# Altium project Stabilizer_Piezo_Driver.PrjPCB (part 1 of 2)
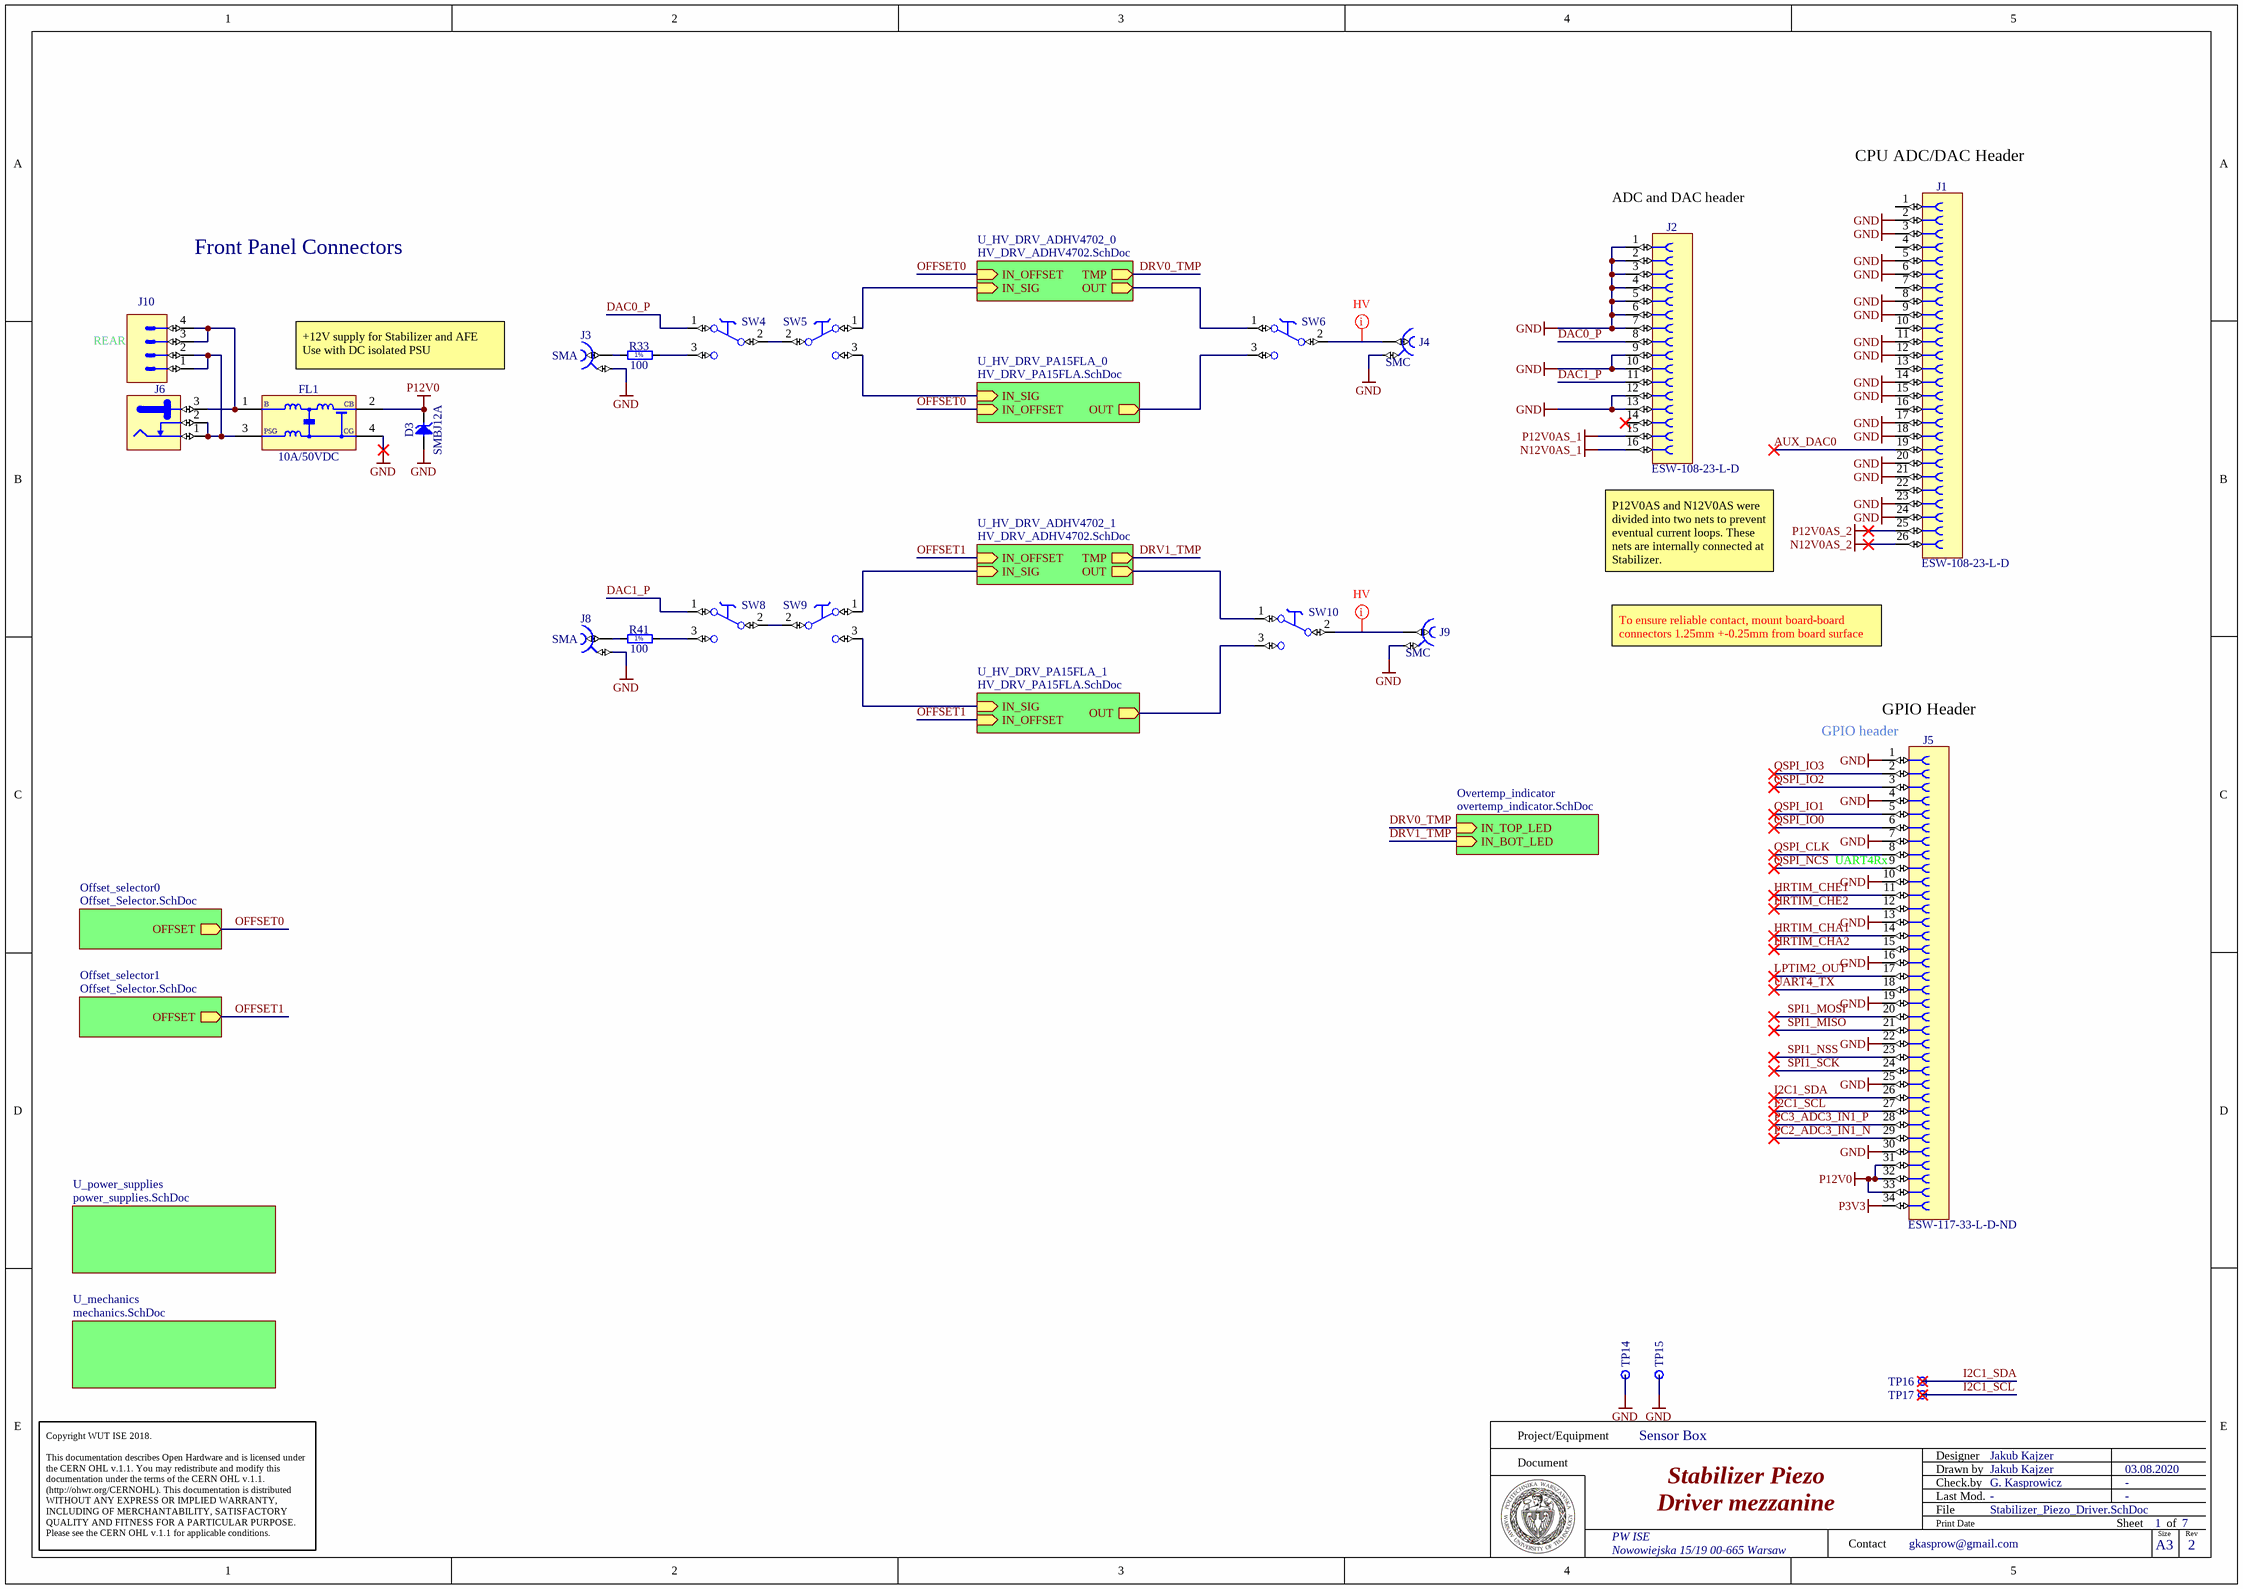
[diagram p0: Stabilizer_Piezo_Driver.SchDoc]
ProjAddress1: Department of Physics; ProjAddress2: University of Oxford; ProjAddress3: UK; ProjOrganization: Ion Trapping Group; ProjRevision: 1.0
7 sheets, 236 parts. Net scope: hierarchical (ports join the sheet entries above them; power ports are global).
Board file: Stabilizer_Piezo_Driver.PcbDoc
Sheets:
  Stabilizer_Piezo_Driver.SchDoc
    U_power_supplies = power_supplies.SchDoc
    U_mechanics = mechanics.SchDoc
    U_HV_DRV_ADHV4702_1 = HV_DRV_ADHV4702.SchDoc
    U_HV_DRV_PA15FLA_0 = HV_DRV_PA15FLA.SchDoc
    U_HV_DRV_PA15FLA_1 = HV_DRV_PA15FLA.SchDoc
    Overtemp_indicator = overtemp_indicator.SchDoc
    Offset_selector0 = Offset_Selector.SchDoc
    Offset_selector1 = Offset_Selector.SchDoc
    U_HV_DRV_ADHV4702_0 = HV_DRV_ADHV4702.SchDoc

## Sheet Stabilizer_Piezo_Driver.SchDoc: Stabilizer Piezo
size 420 x 297 mm; CheckedBy: G. Kasprowicz; Author: Jakub Kajzer; CompanyName: WUT ISE; DrawnBy: Jakub Kajzer; Organization: WUT ISE; Address1: PW ISE; Address2: Nowowiejska 15/19 00-665 Warsaw; Address3: gkasprow@gmail.com; DocumentNumber: 1; Revision: 2; SheetNumber: 1; SheetTotal: 7; ModifiedBy: -; CreateDate: 03.08.2020; CheckedDate: -; Title2: Driver mezzanine; DivGrp: WUT ISE; Designer: Jakub Kajzer; ModifiedDate: -; ProjectName: Sensor Box

### Parts
D3  SMBJ12A  [DIOM5336X265N]
FL1  10A/50VDC  [FIL_MURATA_BNX02]
J1  ESW-108-23-L-D  [ESW-113-23-L-D]
J2  ESW-108-23-L-D  [ESW-108-23-L-D]
J3  SMA  [RF249BT0050GHDW]
J4  SMC  [JOHNSON_131-6701-341]
J5  Manufacturer Part Number: ESW-117-33-L-D-ND  [ESW-117-23-L-D]  (hidden comment: ESW-108-23-L-D)
J6  Jack  [SWITCHCRAFT_L712RA]  (value not drawn)
J8  SMA  [RF249BT0050GHDW]
J9  SMC  [JOHNSON_131-6701-341]
J10  Mini-Fit Jr.™  [MOLEX_39-30-0040]  (value not drawn)
R33  100  [RESC1005X40N]
R41  100  [RESC1005X40N]
SW4  Switch  [SW_C&K_1101M2S3CQE2]  (value not drawn)
SW5  Switch  [SW_C&K_1101M2S3CQE2]  (value not drawn)
SW6  Switch  [SW_C&K_1101M2S3CQE2]  (value not drawn)
SW8  Switch  [SW_C&K_1101M2S3CQE2]  (value not drawn)
SW9  Switch  [SW_C&K_1101M2S3CQE2]  (value not drawn)
SW10  Switch  [SW_C&K_1101M2S3CQE2]  (value not drawn)
TP14  Test Point  [TPS127]  (value not drawn)
TP15  Test Point  [TPS127]  (value not drawn)
TP16  Test Point  [TPS127]  (value not drawn)
TP17  Test Point  [TPS127]  (value not drawn)

### Sub-sheets
Offset_selector0 = Offset_Selector.SchDoc: OFFSET (out)
Offset_selector1 = Offset_Selector.SchDoc: OFFSET (out)
Overtemp_indicator = overtemp_indicator.SchDoc: IN_TOP_LED (in), IN_BOT_LED (in)
U_HV_DRV_ADHV4702_0 = HV_DRV_ADHV4702.SchDoc: OUT (out), TMP (out), IN_SIG (in), IN_OFFSET (in)
U_HV_DRV_ADHV4702_1 = HV_DRV_ADHV4702.SchDoc: OUT (out), TMP (out), IN_SIG (in), IN_OFFSET (in)
U_HV_DRV_PA15FLA_0 = HV_DRV_PA15FLA.SchDoc: OUT (out), IN_SIG (in), IN_OFFSET (in)
U_HV_DRV_PA15FLA_1 = HV_DRV_PA15FLA.SchDoc: OUT (out), IN_OFFSET (in), IN_SIG (in)
U_mechanics = mechanics.SchDoc: no entries
U_power_supplies = power_supplies.SchDoc: no entries

### Nets
GND: D3.2(A) FL1.4(CG) J1.2 J1.3 J1.5 J1.6 J1.8 J1.9 J1.11 J1.12 J1.14 J1.15 J1.17 J1.18 J1.20 J1.21 J1.23 J1.24 J2.1 J2.2 J2.3 J2.4 J2.5 J2.6 J2.7 J2.9 J2.10 J2.12 J2.13 J3.2 J4.2 J5.1 J5.4 J5.7 J5.10 J5.13 J5.16 J5.19 J5.22 J5.25 J5.30 J8.2 J9.2 TP14.1 TP15.1
N12V0AS_1: J2.16
N12V0AS_2: J1.26
P3V3: J5.34
P12V0: D3.1(C) FL1.2(CB) J5.31 J5.32 J5.33
P12V0AS_1: J2.15
P12V0AS_2: J1.25
AUX_DAC0: J1.19
DAC0_P: J2.8 SW4.1(NC)
DAC1_P: J2.11 SW8.1(NC)
DRV0_TMP: sheet Overtemp_indicator/IN_TOP_LED, sheet U_HV_DRV_ADHV4702_0/TMP
DRV1_TMP: sheet U_HV_DRV_ADHV4702_1/TMP, sheet Overtemp_indicator/IN_BOT_LED
HRTIM_CHA1: J5.14
HRTIM_CHA2: J5.15
HRTIM_CHE1: J5.11
HRTIM_CHE2: J5.12
I2C1_SCL: J5.27 TP17.1
I2C1_SDA: J5.26 TP16.1
LPTIM2_OUT: J5.17
OFFSET0: sheet U_HV_DRV_PA15FLA_0/IN_OFFSET, sheet Offset_selector0/OFFSET, sheet U_HV_DRV_ADHV4702_0/IN_OFFSET
OFFSET1: sheet U_HV_DRV_ADHV4702_1/IN_OFFSET, sheet U_HV_DRV_PA15FLA_1/IN_OFFSET, sheet Offset_selector1/OFFSET
OUT: SW10.1(NC) ; sheet U_HV_DRV_ADHV4702_1/OUT
OUT: SW6.1(NC) ; sheet U_HV_DRV_ADHV4702_0/OUT  [a separate net that carries the same name]
PC2_ADC3_IN1_N: J5.29
PC3_ADC3_IN1_P: J5.28
QSPI_CLK: J5.8
QSPI_IO0: J5.6
QSPI_IO1: J5.5
QSPI_IO2: J5.3
QSPI_IO3: J5.2
QSPI_NCS: J5.9
SPI1_MISO: J5.21
SPI1_MOSI: J5.20
SPI1_NSS: J5.23
SPI1_SCK: J5.24
UART4_TX: J5.18
NetFL1_1: FL1.1(B) J6.3 J10.3 J10.4
NetFL1_3: FL1.3(PSG) J6.1 J6.2 J10.1 J10.2
NetJ3_1: J3.1 R33.1
NetJ4_1: J4.1 SW6.2(C)
NetJ8_1: J8.1 R41.1
NetJ9_1: J9.1 SW10.2(C)
NetR5A_1: SW9.1(NC) ; sheet U_HV_DRV_ADHV4702_1/IN_SIG
NetR5B_1: SW5.1(NC) ; sheet U_HV_DRV_ADHV4702_0/IN_SIG
NetR8A_2: SW6.3(NO) ; sheet U_HV_DRV_PA15FLA_0/OUT
NetR8B_2: SW10.3(NO) ; sheet U_HV_DRV_PA15FLA_1/OUT
NetR12A_1: SW5.3(NO) ; sheet U_HV_DRV_PA15FLA_0/IN_SIG
NetR12B_1: SW9.3(NO) ; sheet U_HV_DRV_PA15FLA_1/IN_SIG
NetR33_2: R33.2 SW4.3(NO)
NetR41_2: R41.2 SW8.3(NO)
NetSW4_2: SW4.2(C) SW5.2(C)
NetSW8_2: SW8.2(C) SW9.2(C)

Not connected (* = marked no-connect by the designer): J1 1 4 7 10 13 16 22; J2 14*

### Layout directives
net class HV: NetJ4_1, NetJ9_1

### Notes on the sheet
- (near J1) CPU ADC/DAC Header
- Front Panel Connectors
- (near J2) ADC and DAC header
- (near J10) REAR
- +12V supply for Stabilizer and AFE
  Use with DC isolated PSU
- (near J2) P12V0AS and N12V0AS were divided into two nets to prevent eventual current loops. These nets are internally connected at Stabilizer.
- To ensure reliable contact, mount board-board connectors 1.25mm +-0.25mm from board surface
- (near J5) GPIO Header
- (near J5) GPIO header
- (near J5) UART4Rx
- Project/Equipment
- Document
- Designer
- Drawn by
- Check.by
- Copyright WUT ISE 2018.
  This documentation describes Open Hardware and is licensed under the CERN OHL v.1.1. You may redistribute and modify this documentation under the terms of the CERN OHL v.1.1. (http://ohwr.org/CERNOHL). This documentation is distributed WITHOUT ANY EXPRESS OR IMPLIED WARRANTY, INCLUDING OF MERCHANTABILITY, SATISFACTORY QUALITY AND FITNESS FOR A PARTICULAR PURPOSE. Please see the CERN OHL v.1.1 for applicable conditions.
- Contact
- File
- Last Mod.
- Print Date
- Sheet
- Size
- A3
- of
- Rev
- (in symbol R0402_100R_1%_0.0625W_100PPM) 1%

### Library data of the parts
D3 = SMBJ12A: Zener Diode; Part Description: Uni-Directional Transient Voltage Suppressor Diode; Manufacturer: FAIRCHILD SEMICONDUCTOR; Voltage: 12V; Power: 600W; PressFit: No; Bonding: No; Part Number: SMBJ12A; Component Kind: Standard; Component Type: Standard; Device: SMBJ12A; PackageDescription: DO-214-AA/SMB Diode, Molded Body; 5.34mm L X 3.625mm W X 2.65mm H, IPC Medium Density; Manufacturer Part Number: SMBJ12A; Pin Count: 2; Case: DO-214AA; Mounted: Yes; Socket: No; SMD: Yes; Sense: No; ComponentHeight: 2.65mm; HelpURL: \\cern.ch\dfs\Applications\Altium\Datasheets\SMBJ.pdf; Author: CERN DEM JLC; CreateDate: 10/04/2013; LatestRevisionDate: 10/04/2013
FL1 = FIL_MURATA_BNX022-01L: Block Type EMIFIL (LC Combined); Part Description: Block Type EMIFIL (LC Combined) SMD Type, BNX02* Series; Manufacturer: MURATA; Resistance: 0.5R; Part Number: FIL_MURATA_BNX022-01L; Component Kind: Standard; Component Type: Standard; Pin Count: 2; Value: 10A/50VDC; Status: None; Manufacturer Part Number: BNX022-01L; Mounted: Yes; Socket: No; SMD: Yes; Sense: No; ComponentHeight: 3.3mm; HelpURL: \\cern.ch\dfs\Applications\Altium\Datasheets\FIL_MURATA_BNX022-01L.pdf; Author: CERN DEM JLC; CreateDate: 10/10/2012; LatestRevisionDate: 10/10/2012
J1 = ESW-113-23-L-D: Connector Elevated Socket 26 POS 2.54mm, 13.59mm height; Manufacturer: Samtec; Manufacturer Part Number: ESW-108-23-L-D
J2 = ESW-108-23-L-D: Connector Elevated Socket 16 POS 2.54mm, 13.59mm height; Manufacturer: Samtec; Manufacturer Part Number: ESW-108-23-L-D
J3 J8 = CON_SMA_RF249BT0050GHDW: 50 Ohm Through Hole SMA Right Angle PCB Jack; Part Number: AdamTech_RF249BT0050GHDW; Manufacturer: AdamTech; PressFit: No; Component Kind: Standard; Component Type: Standard; Pin Count: 5; Family: SMA; Mounted: Yes; Socket: No; SMD: No; Sense: No; Status: None; Part Description: 50 Ohm Through Hole SMA Right Angle PCB Jack; Manufacturer Part Number: RF249BT0050GHDW; ComponentHeight: 10.44mm; HelpURL: \\cern.ch\dfs\Applications\Altium\Datasheets\AMPHENOL_132203.pdf; Author: GK; CreateDate: 06.10.2016; LatestRevisionDate: 06.10.2016
J4 J9 = JOHNSON_131-6701-341: Part Description: SMC 50 Ohms Right Angle Bulkhead Jack Receptacle; PressFit: No; Part Number: JOHNSON_131-6701-341; Component Kind: Standard; Component Type: Standard; Pin Count: 2; Family: SMC; Mounted: Yes; Socket: No; SMD: No; Sense: No; Status: None; Manufacturer: JOHNSON; Manufacturer Part Number: 131-6701-341; ComponentHeight: 7.67mm; HelpURL: \\cern.ch\dfs\Applications\Altium\Datasheets\JOHNSON_131-6701-341.pdf; Author: CERN DEM JLC; CreateDate: 16.02.2010; LatestRevisionDate: 12.01.2017
J5 = ESW-117-23-L-D: Connector Elevated Socket 34 POS 2.54mm, 13.59mm height; Manufacturer: Samtec
J6 = SWITCHCRAFT_L712RA: 24V /3. 5A, 2.1mm Diameter Pin, SMD DC Power Supply Connector With  Break Contact; Part Description: 12V/5A, 2.5mm Diameter Pin, THT DC Power Supply Connector With  Break Contact; Manufacturer Part Number: L712RA; PressFit: No; Part Number: SWITCHCRAFT_L712RA; Component Kind: Standard; Component Type: Standard; Pin Count: 3; Family: Jack; Mounted: Yes; Socket: No; SMD: No; Sense: No; Status: None; Manufacturer: SWITCHCRAFT; ComponentHeight: 11mm; HelpURL: \\cern.ch\dfs\Applications\Altium\Datasheets\LUMBERG_161314.pdf; Author: GK; CreateDate: 15.02.2011; LatestRevisionDate: 20.07.2011
J10 = MOLEX_39-30-0040: Connector 4 Male; Part Description: 4.20mm (.165") Pitch Mini-Fit Jr. Header, Dual Row, Right Angle with Snap-in Plastic Peg PCB Lock, 4 Circuits; Manufacturer: MOLEX; PressFit: No; Part Number: MOLEX_39-30-0040; Component Kind: Standard; Component Type: Standard; Pin Count: 4; Family: Mini-Fit Jr.™; Mounted: Yes; Socket: No; SMD: No; Sense: No; Status: None; Manufacturer Part Number: 39-30-0040; ComponentHeight: 11.4mm; HelpURL: \\cern.ch\dfs\Applications\Altium\Datasheets\MOLEX_39-30-0040.pdf; Author: CERN DEM JLC; CreateDate: 02/10/2018; LatestRevisionDate: 02/10/2018
R33 R41 = R0402_100R_1%_0.0625W_100PPM: Resistor - 1%; Part Description: General Purpose Thick Film Chip Resistor; Manufacturer: GENERIC; Manufacturer1 Part Number: 232270671001L; TC: ±100ppm/°C; PressFit: No; Part Number: R0402_100R_1%_0.0625W_100PPM; Component Kind: Standard; Component Type: Standard; Pin Count: 2; Value: 100; Status: Not Recommended; Power: 0.0625W; Tolerance: ±1%; Manufacturer Part Number: R0402_100R_1%_0.0625W_100PPM; Case: 0402; Mounted: Yes; Sense: No; Socket: No; SMD: Yes; Manufacturer1 Example: YAGEO PHYCOMP; Manufacturer1 ComponentHeight: 0.4mm; HelpURL: \\cern.ch\dfs\Applications\Altium\Datasheets\R0402_Phycomp_RC0402.pdf; Author: CERN DEM JLC; CreateDate: 03.12.2007; LatestRevisionDate: 17.10.2012
SW4-SW6 SW8-SW10 = SW_C&K_1101M2S3CQE2: SPDT Switch; Part Description: PC Thru-Hole SPDT Slide Switch, .200" High Actuator, C&K 1000 Series; Manufacturer: C&K; PressFit: No; Sense Comment: Non-washable; Part Number: SW_C&K_1101M2S3CQE2; Component Kind: Standard; Component Type: Standard; Pin Count: 3; PackageDescription: PC Thru-Hole SPDT Slide Switch, .200" High Actuator, C&K 1000 Series; Family: Switch; Mounted: Yes; Socket: No; SMD: No; Sense: Yes; Status: None; Manufacturer Part Number: 1101M2S3CQE2; ComponentHeight: 13.34mm; HelpURL: \\cern.ch\dfs\Applications\Altium\Datasheets\SW_C&K_1101M2S3CQE2.pdf; Author: CERN DEM BC; CreateDate: 30.01.2019; LatestRevisionDate: 30.01.2019
TP14-TP17 = SMD_PAD_1.27X1.27MM: Part Description: 1.27mm x 1.27mm PCB Copper Area (SMD Test Point); Mounted: No; Part Number: SMD_PAD_1.27X1.27MM; Component Kind: Standard (No BOM); Component Type: Standard (No BOM); Pin Count: 1; Family: Test Point; Socket: No; SMD: Yes; Sense: No; Status: None; ComponentHeight: 0mm; HelpURL: Undefined; Author: CERN DEM JLC; CreateDate: 12/01/2008; LatestRevisionDate: 12/01/2008; PackageDescription: 1.27mm x 1.27mm PCB Copper Area (SMD Test Point)

## Sheet power_supplies.SchDoc: Power Supplies and High
size 420 x 297 mm; CheckedBy: G. Kasprowicz; Author: Jakub Kajzer; CompanyName: WUT ISE; DrawnBy: Jakub Kajzer; Organization: WUT ISE; Address1: PW ISE; Address2: Nowowiejska 15/19 00-665 Warsaw; Address3: gkasprow@gmail.com; DocumentNumber: 5; Revision: 2; SheetNumber: 5; SheetTotal: 7; ModifiedBy: -; CreateDate: 03.08.2020; CheckedDate: -; Title2: Voltage Capacitors Discharge; DivGrp: WUT ISE; Designer: Jakub Kajzer; ModifiedDate: -; ProjectName: Sensor Box
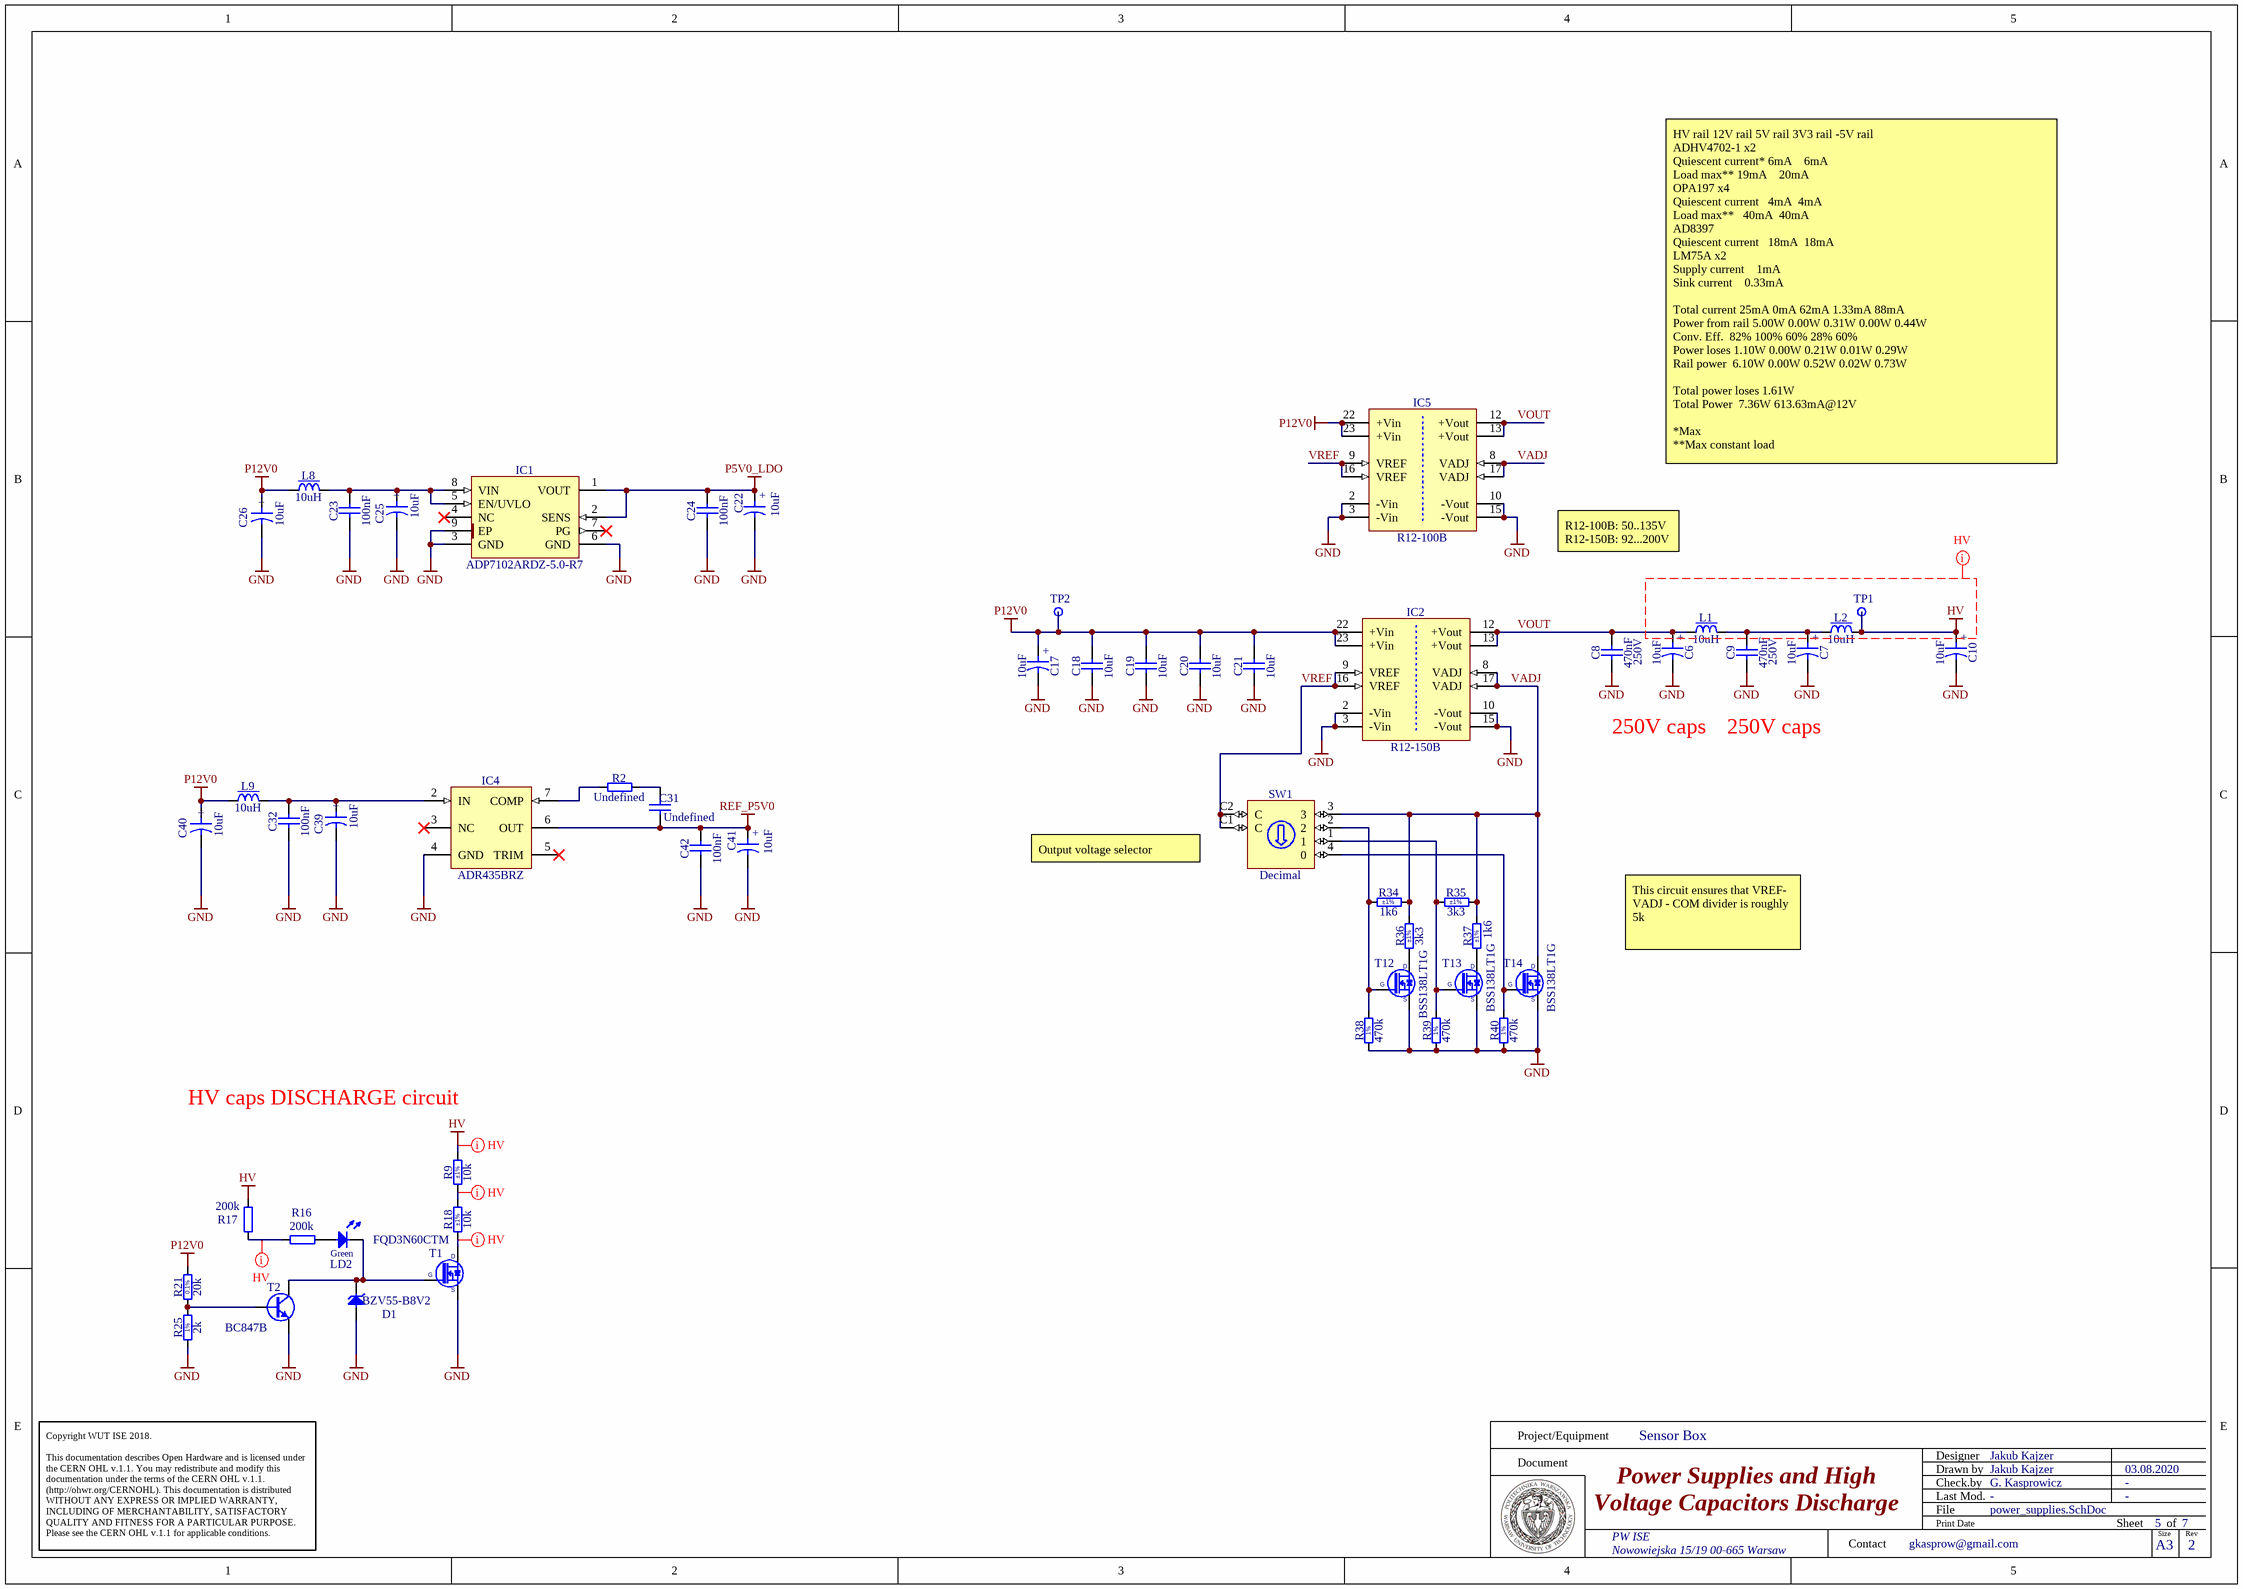
[diagram p1: power_supplies.SchDoc]

### Parts
C6  10uF  [CAPAE]
C7  10uF  [CAPAE]
C8  470nF  Voltage: 250V  [CAPC4532X185N]
C9  470nF  Voltage: 250V  [CAPC4532X185N]
C10  10uF  [CAPAE]
C17  10uF  [CAPMP6032X280N]
C18  10uF  [CAPC2012X95N]
C19  10uF  [CAPC2012X95N]
C20  10uF  [CAPC2012X95N]
C21  10uF  [CAPC2012X95N]
C22  10uF  [CAPMP3216X180N]
C23  100nF  [CAPC1005X55N]
C24  100nF  [CAPC1005X55N]
C25  10uF  [CAPMP3216X180N]
C26  10uF  [CAPMP6032X280N]
C31  Undefined  [CAPC1005X55N]
C32  100nF  [CAPC1005X55N]
C39  10uF  [CAPMP3216X180N]
C40  10uF  [CAPMP6032X280N]
C41  10uF  [CAPMP3216X180N]
C42  100nF  [CAPC1005X55N]
D1  BZV55-B8V2  [DIOMELF3515N]
IC1  ADP7102ARDZ-5.0-R7  [SOIC127P600X175-9N-R241X309]
IC2  R12-150B  [DCDC_RECOM_Rxx-B]
IC4  ADR435BRZ  [SOIC127P600X175-8N]
IC5  R12-100B  [DCDC_RECOM_Rxx-B]
L1  10uH  [IND_MURATA-PS_8400]
L2  10uH  [IND_MURATA-PS_8400]
L8  10uH  [IND_MURATA-PS_8400]
L9  10uH  [IND_MURATA-PS_8400]
LD2  Green  [LED_AVAGO_HSMG-C150]
R2  Undefined  [RESC1005X40N]
R9  10k  Tolerance: ±1%  [RESC3216X65N]
R16  200k  [RESC3216X65N]
R17  200k  [RESC3216X65N]
R18  10k  Tolerance: ±1%  [RESC3216X65N]
R21  20k  [RESC1608X55N]
R25  2k  [RESC1005X40N]
R34  1k6  Tolerance: ±1%  [RESC1005X40N]
R35  3k3  Tolerance: ±1%  [RESC1005X40N]
R36  3k3  Tolerance: ±1%  [RESC1005X40N]
R37  1k6  Tolerance: ±1%  [RESC1005X40N]
R38  470k  [RESC1005X40N]
R39  470k  [RESC1005X40N]
R40  470k  [RESC1005X40N]
SW1  Decimal  [SW_APEM_PT65121L508]
T1  FQD3N60CTM  [TO228P991X239-3N-R552X520]
T2  BC847B  [SOT95P230X110-3N]
T12  BSS138LT1G  [SOT95P240X110-3N]
T13  BSS138LT1G  [SOT95P240X110-3N]
T14  BSS138LT1G  [SOT95P240X110-3N]
TP1  Test Point  [TPS127]  (value not drawn)
TP2  Test Point  [TPS127]  (value not drawn)

### Nets
GND: C6.2 C7.2 C8.1 C9.1 C10.2 C17.2 C18.1 C19.1 C20.1 C21.1 C22.2 C23.1 C24.1 C25.2 C26.2 C32.1 C39.2 C40.2 C41.2 C42.1 D1.2(A) IC1.3(GND) IC1.6(GND) IC1.9(EP) IC2.2(-Vin) IC2.3(-Vin) IC2.10(-Vout) IC2.15(-Vout) IC4.4(GND) IC5.2(-Vin) IC5.3(-Vin) IC5.10(-Vout) IC5.15(-Vout) R25.1 R38.1 R39.1 R40.1 T1.2(S) T2.2(E) T12.2(S) T13.2(S) T14.2(S)
HV: C10.1 L2.2 R9.2 R17.2 TP1.1
P5V0_LDO: C22.1 C24.2 IC1.1(VOUT) IC1.2(SENS)
P12V0: C17.1 C18.2 C19.2 C20.2 C21.2 C26.1 C40.1 IC2.22(+Vin) IC2.23(+Vin) IC5.22(+Vin) IC5.23(+Vin) L8.1 L9.1 R21.2 TP2.1
REF_P5V0: C31.1 C41.1 C42.2 IC4.6(OUT)
VADJ: IC2.8(VADJ) IC2.17(VADJ) IC5.8(VADJ) IC5.17(VADJ) R34.2 R35.2 R36.2 R37.2 SW1.3 T14.3(D)
VOUT: C6.1 C8.2 IC2.12(+Vout) IC2.13(+Vout) IC5.12(+Vout) IC5.13(+Vout) L1.1
VREF: IC2.9(VREF) IC2.16(VREF) IC5.9(VREF) IC5.16(VREF) SW1.C1(C) SW1.C2(C)
NetC7_1: C7.1 C9.2 L1.2 L2.1
NetC23_2: C23.2 C25.1 IC1.5(EN/UVLO) IC1.8(VIN) L8.2
NetC31_2: C31.2 R2.2
NetC32_2: C32.2 C39.1 IC4.2(IN) L9.2
NetD1_1: D1.1(C) LD2.1(C) T1.1(G) T2.3(C)
NetIC4_7: IC4.7(COMP) R2.1
NetLD2_2: LD2.2(A) R16.1
NetR9_1: R9.1 R18.2
NetR16_2: R16.2 R17.1
NetR18_1: R18.1 T1.3(D)
NetR21_1: R21.1 R25.2 T2.1(B)
NetR34_1: R34.1 R38.2 SW1.2 T12.1(G)
NetR35_1: R35.1 R39.2 SW1.1 T13.1(G)
NetR36_1: R36.1 T12.3(D)
NetR37_1: R37.1 T13.3(D)
NetR40_2: R40.2 SW1.4(0) T14.1(G)

Not connected (* = marked no-connect by the designer): IC1 4(NC)* 7(PG)*; IC4 3(NC)* 5(TRIM)*

### Layout directives
net class HV: HV, NetR9_1, NetR16_2, NetR18_1

### Notes on the sheet
- HV rail	12V rail	5V rail	3V3 rail	-5V rail
  ADHV4702-1 x2
  Quiescent current*	6mA				6mA
  Load max**	19mA				20mA
  OPA197 x4
  Quiescent current			4mA		4mA
  Load max**			40mA		40mA
  AD8397
  Quiescent current			18mA		18mA
  LM75A x2
  Supply current				1mA
  Sink current				0.33mA
  Total current	25mA	0mA	62mA	1.33mA	88mA
  Power from rail	5.00W	0.00W	0.31W	0.00W	0.44W
  Conv. Eff.		82%	100%	60%	28%	60%
  Power loses	1.10W	0.00W	0.21W	0.01W	0.29W
  Rail power		6.10W	0.00W	0.52W	0.02W	0.73W
  Total power loses	1.61W
  Total Power 	7.36W	613.63mA@12V
  *Max
  **Max constant load
- R12-100B: 50..135V
  R12-150B: 92...200V
- (near SW1) Output voltage selector
- This circuit ensures that VREF- VADJ - COM divider is roughly 5k
- Labels drawn without touching a wire or pin: 250V caps, HV caps DISCHARGE circuit
- Project/Equipment
- Document
- Designer
- Drawn by
- Check.by
- Copyright WUT ISE 2018.
  This documentation describes Open Hardware and is licensed under the CERN OHL v.1.1. You may redistribute and modify this documentation under the terms of the CERN OHL v.1.1. (http://ohwr.org/CERNOHL). This documentation is distributed WITHOUT ANY EXPRESS OR IMPLIED WARRANTY, INCLUDING OF MERCHANTABILITY, SATISFACTORY QUALITY AND FITNESS FOR A PARTICULAR PURPOSE. Please see the CERN OHL v.1.1 for applicable conditions.
- Contact
- File
- Last Mod.
- Print Date
- Sheet
- Size
- A3
- of
- Rev
- (in symbol CAE530-540_10UF_35V_20%) +
- (in symbol CTE3216-18_10UF_16V_20%_AVX_TCJ) +
- (in symbol CTE6032-28_10UF_25V_10%_LESR0500) +
- (in symbol R0402_2K_1%_0.0625W_100PPM) 1%
- (in symbol R0402_470K_1%_0.0625W_100PPM) 1%
- (in symbol R0603_20K_0.1%_0.063W_10PPM) 0.1%

### Library data of the parts
C6 C7 C10 = CAE530-540_10UF_35V_20%: Polarised capacitor; Part Number: CAE12.5-13.5_10UF_250V_20%; Part Description: Aluminum Electrolytic SMT Capacitor; Manufacturer: KEMET; Manufacturer Part Number: EDH106M250A9RAA; Voltage: 250V; Tolerance: ±20%; Component Kind: Standard; Component Type: Standard; Footprint: CAPAE_12.5x13.5; Pin Count: 2; Value: 10uF; Status: Not Recommended; Mounted: Yes; Socket: No; SMD: Yes; Sense: No; ComponentHeight: 13.5mm; CreateDate: 03.12.2007; LatestRevisionDate: 05.11.2014
C8 C9 = CC1812_470NF_250V_10%_X7R_FT-CAP: Non-polarised capacitor; Part Description: Flexible Termination System (FT-CAP) SMD Multilayer Ceramic  Chip Capacitor; Manufacturer: KEMET; Manufacturer Part Number: C1812X474KARACTU; TC: X7R; Tolerance: ±10%; Part Number: CC1812_470NF_250V_10%_X7R_FT-CAP; Component Kind: Standard; Component Type: Standard; Pin Count: 2; Value: 470nF; Status: None; Case: 1812; Mounted: Yes; Socket: No; SMD: Yes; Sense: No; ComponentHeight: 1.85mm; HelpURL: \\cern.ch\dfs\Applications\Altium\Datasheets\CC1812_X7R_KEMET_FT-CAP.pdf; Author: CERN DEM JLC; CreateDate: 15.09.2014; LatestRevisionDate: 15.09.2014
C17 C26 C40 = CTE6032-28_10UF_25V_10%_LESR0500: Polarised capacitor; Part Description: Low ESR 0R5 Solid Tantalum Chip Capacitor; Manufacturer: GENERIC; Manufacturer1 Part Number: TPSC106K025R0500; Voltage: 25V; Tolerance: ±10%; Part Number: CTE6032-28_10UF_25V_10%_LESR0500; Component Kind: Standard; Component Type: Standard; Pin Count: 2; Value: 10uF; Status: Preferred; Manufacturer Part Number: CTE6032-28_10UF_25V_10%_LESR0500; Case: C; Mounted: Yes; Socket: No; SMD: Yes; Sense: No; Manufacturer1 Example: AVX; Manufacturer1 ComponentHeight: 2.8mm; HelpURL: \\cern.ch\dfs\Applications\Altium\Datasheets\CTE-LESR_AVX_TPS.pdf; Author: CERN DEM JLC; CreateDate: 05/05/2008; LatestRevisionDate: 20/01/2009
C18-C21 = CC0805_10UF_25V_10%_X5R: Non-polarised capacitor; Part Description: SMD Multilayer Chip Ceramic Capacitor; Manufacturer: GENERIC; Manufacturer1 Part Number: GRM219R61E106KA12D; Voltage: 25V; TC: X5R; Tolerance: ±10%; Part Number: CC0805_10UF_25V_10%_X5R; Component Kind: Standard; Component Type: Standard; Pin Count: 2; Value: 10uF; Status: Preferred; Manufacturer Part Number: CC0805_10UF_25V_10%_X5R; Case: 0805; Mounted: Yes; Socket: No; SMD: Yes; Sense: No; Manufacturer1 Example: MURATA; Manufacturer1 ComponentHeight: 0.95mm; HelpURL: \\cern.ch\dfs\Applications\Altium\Datasheets\CC0805_X5R_MURATA_GRM.pdf; Author: CERN DEM JLC; CreateDate: 25/10/2012; LatestRevisionDate: 06/09/2016
C22 C25 C39 C41 = CTE3216-18_10UF_16V_20%_AVX_TCJ: Polarised capacitor; Part Description: ESR 0R200 Tantalum Solid Electrolytic Chip Capacitor with Conductive Polymer Electrode; Manufacturer: AVX; Manufacturer Part Number: TCJA106M016R0200; Voltage: 16V; Tolerance: ±20%; Part Number: CTE3216-18_10UF_16V_20%_AVX_TCJ; Component Kind: Standard; Component Type: Standard; Pin Count: 2; Value: 10uF; Status: Preferred; Case: A; Mounted: Yes; Socket: No; SMD: Yes; Sense: No; ComponentHeight: 1.8mm; HelpURL: \\cern.ch\dfs\Applications\Altium\Datasheets\CTE_AVX_TCJ.pdf; Author: CERN DEM JLC; CreateDate: 29.03.2012; LatestRevisionDate: 29.03.2012
C23 C24 C32 C42 = CC0402_100NF_16V_10%_X5R: Non-polarised capacitor; Part Description: SMD Multilayer Chip Ceramic Capacitor; Manufacturer: GENERIC; Manufacturer1 Part Number: GRM155R61C104KA88D; Voltage: 16V; TC: X5R; Tolerance: ±10%; Part Number: CC0402_100NF_16V_10%_X5R; Component Kind: Standard; Component Type: Standard; Pin Count: 2; Value: 100nF; Status: None; Manufacturer Part Number: CC0402_100NF_16V_10%_X5R; Case: 0402; Mounted: Yes; Socket: No; SMD: Yes; Sense: No; Manufacturer1 Example: MURATA; Manufacturer1 ComponentHeight: 0.55mm; HelpURL: \\cern.ch\dfs\Applications\Altium\Datasheets\CC0402_X5R_MURATA_GRM.pdf; Author: CERN DEM JLC; CreateDate: 10.12.2013; LatestRevisionDate: 10.12.2013
C31 = CC0402_NO-VALUE: Non-polarised capacitor; Part Description: Reserved Footprint For 0402(1005) Chip Ceramic Capacitor; Mounted: No; Part Number: CC0402_NO-VALUE; Component Kind: Standard; Component Type: Standard; Pin Count: 2; Value: Undefined; Status: None; Manufacturer: Undefined; Manufacturer Part Number: CC0402_NO-VALUE; Case: 0402; Socket: No; SMD: Yes; Sense: No; Manufacturer1 ComponentHeight: 0.55mm; HelpURL: Undefined; Author: CERN DEM JLC; CreateDate: 14.01.2014; LatestRevisionDate: 14.01.2014
D1 = BZV55-B8V2: Zener Diode; Part Description: Voltage Regulator Diode; Manufacturer: NEXPERIA; Voltage: 8V2; Power: 500mW; PressFit: No; Bonding: No; Part Number: BZV55-B8V2; Component Kind: Standard; Component Type: Standard; Device: BZV55-B8V2; PackageDescription: SOD80C, MELF Diode, 2-Leads, Body 3.5x1.5mm, IPC Medium Density; Manufacturer Part Number: BZV55-B8V2; Pin Count: 2; Case: SOD-80C; Mounted: Yes; Socket: No; SMD: Yes; Sense: No; ComponentHeight: 1.6mm; HelpURL: \\cern.ch\dfs\Applications\Altium\Datasheets\BZV55.pdf; Author: CERN DEM JLC; CreateDate: 06.05.2008; LatestRevisionDate: 22.01.2018
IC1 = ADP7102ARDZ-5.0-R7: 300 mA, Low Noise, CMOS LDO Linear Regulator; Part Description: 5V, 300mA, Low Noise, CMOS LDO Linear Regulator; Manufacturer: ANALOG DEVICES; PressFit: No; Bonding: No; Part Number: ADP7102ARDZ-5.0-R7; Component Kind: Standard; Component Type: Standard; Device: ADP7102ARDZ-5.0-R7; PackageDescription: SOIC 8, Pitch 1.27mm - Body 3.9x4.9mm, (w/thermal tab 2.41mm X 3.098mm), IPC Medium Density; Manufacturer Part Number: ADP7102ARDZ-5.0-R7; Pin Count: 8; Case: SOIC8; Mounted: Yes; Socket: No; SMD: Yes; Sense: No; ComponentHeight: 1.75mm; HelpURL: \\cern.ch\dfs\Applications\Altium\Datasheets\ADP7102ARDZ-5.0-R7.pdf; Author: CERN DEM JLC; CreateDate: 17.03.2014; LatestRevisionDate: 17.03.2014
IC2 = R12-150B: RECOM, Rxx-B Series, Single Output DCDC Converter; Part Description: 10-14VDC to 92-200VDC, 3kVDC Isolated, 5W DC-DC Converter; PressFit: No; Bonding: No; Part Number: R12-150B; Component Kind: Standard; Component Type: Standard; Device: R12-150B; PackageDescription: Rxx-B Series, Body 31.8x20.3mm, DIP24 Package; Manufacturer: RECOM; Manufacturer Part Number: R12-150B; Pin Count: 12; Mounted: Yes; Socket: No; SMD: No; Sense: No; ComponentHeight: 9.9mm; HelpURL: \\cern.ch\dfs\Applications\Altium\Datasheets\R12-150B.pdf; Author: CERN DEM MR; CreateDate: 29.08.2019; LatestRevisionDate: 29.08.2019
IC4 = ADR435BRZ: 5V Ultralow Noise XFET Voltage References with Current Sink and Source Capability; Part Description: 5V Output,  ±2mV ±0.04% Accuracy, 3ppm/°C Ultralow Noise XFET Voltage References with Current Sink and Source Capability; Manufacturer: ANALOG DEVICES; PressFit: No; Bonding: No; Part Number: ADR435BRZ; Component Kind: Standard; Component Type: Standard; Device: ADR435BRZ; PackageDescription: SOIC 8, Pitch 1.27mm, Body 4x5mm, IPC Medium Density; Manufacturer Part Number: ADR435BRZ; Pin Count: 6; Case: SOIC8; Mounted: Yes; Socket: No; SMD: Yes; Sense: No; ComponentHeight: 1.75mm; HelpURL: \\cern.ch\dfs\Applications\Altium\Datasheets\ADR435BRZ.pdf; Author: CERN DEM JLC; CreateDate: 28.10.2013; LatestRevisionDate: 28.10.2013
IC5 = R12-100B: RECOM, Rxx-B Series, Single Output DCDC Converter; Part Description: 10-14VDC to 50-135VDC, 3kVDC Isolated, 5W DC-DC Converter; PressFit: No; Bonding: No; Part Number: R12-100B; Component Kind: Standard; Component Type: Standard; Device: R12-100B; PackageDescription: Rxx-B Series, Body 31.8x20.3mm, DIP24 Package; Manufacturer: RECOM; Manufacturer Part Number: R12-100B; Pin Count: 12; Mounted: Yes; Socket: No; SMD: No; Sense: No; ComponentHeight: 9.9mm; HelpURL: \\cern.ch\dfs\Applications\Altium\Datasheets\R12-100B.pdf; Author: CERN DEM MR; CreateDate: 29.08.2019; LatestRevisionDate: 29.08.2019
L1 L2 L8 L9 = IND_10UH_10%_MURATA-PS_8400: Inductor With Core; Part Description: Miniature Surface Mount Power Inductor (8400 Serie); Manufacturer: MURATA POWER SOLUTIONS; Manufacturer Part Number: 84103C; Power: 950mA; Resistance: 0.24R; Tolerance: ±10%; Part Number: IND_10UH_10%_MURATA-PS_8400; Component Kind: Standard; Component Type: Standard; Pin Count: 2; Value: 10uH; Status: None; Mounted: Yes; Socket: No; SMD: Yes; Sense: No; ComponentHeight: 2.9mm; HelpURL: \\cern.ch\dfs\Applications\Altium\Datasheets\IND_MURATA-PS_8400.pdf; Author: CERN DEM JLC; CreateDate: 02.07.2012; LatestRevisionDate: 02.07.2012
LD2 = LED_AVAGO_HSMG-C150: LED Green 1C 2A; Part Description: Surface Mount Green LED (1206 Case); Manufacturer: AVAGO TECHNOLOGIES; PressFit: No; Bonding: No; Part Number: LED_AVAGO_HSMG-C150; Component Kind: Standard; Component Type: Standard; Color: Green; PackageDescription: Green Chip LED, 2-Leads, Body 3.2 x1.6mm, IPC Medium Density; Manufacturer Part Number: HSMG-C150; Pin Count: 2; Case: 1206; Mounted: Yes; Socket: No; SMD: Yes; Sense: No; ComponentHeight: 1.2mm; HelpURL: \\cern.ch\dfs\Applications\Altium\Datasheets\LED_AVAGO_HSMG-C150.pdf; Author: CERN DEM MR; CreateDate: 12.01.2018; LatestRevisionDate: 12.01.2018
R2 = R0402_NO-VALUE: Resistor; Part Description: Reserved Footprint For a 0402 (1005) Chip Resistor; PressFit: No; Mounted: No; Part Number: R0402_NO-VALUE; Component Kind: Standard; Component Type: Standard; Pin Count: 2; Value: Undefined; Status: None; Manufacturer: Undefined; Manufacturer Part Number: R0402_NO-VALUE; Case: 0402; Sense: No; Socket: No; SMD: Yes; Manufacturer1 Example: Undefined; Manufacturer1 Part Number: Undefined; Manufacturer1 ComponentHeight: Undefined; HelpURL: Undefined; Author: CERN DEM JLC; CreateDate: 03.12.2007; LatestRevisionDate: 13.03.2008
R9 R18 = R1206_10K_1%_0.25W_100PPM: Resistor - 1%; Part Description: General Purpose Thick Film Chip Resistor; Manufacturer: GENERIC; Manufacturer1 Part Number: NRC12F1002TRF; Power: 0.25W; TC: ±100ppm/°C; PressFit: No; Part Number: R1206_10K_1%_0.25W_100PPM; Component Kind: Standard; Component Type: Standard; Pin Count: 2; Value: 10k; Status: Preferred; Manufacturer Part Number: R1206_10K_1%_0.25W_100PPM; Case: 1206; Mounted: Yes; Sense: No; Socket: No; SMD: Yes; Manufacturer1 Example: NIC COMPONENT; Manufacturer1 ComponentHeight: 0.65mm; HelpURL: \\cern.ch\dfs\Applications\Altium\Datasheets\R1206_NIC_NRC.pdf; Author: CERN DEM JLC; CreateDate: 03.12.2007; LatestRevisionDate: 13.03.2008
R16 R17 = R1206_200K_1%_0.25W_100PPM: Resistor - 1%; Part Description: General Purpose Thick Film Chip Resistor; Manufacturer: GENERIC; Manufacturer1 Part Number: NRC12F2003TRF; Power: 0.25W; TC: ±100ppm/°C; PressFit: No; Part Number: R1206_200K_1%_0.25W_100PPM; Component Kind: Standard; Component Type: Standard; Pin Count: 2; Value: 200k; Status: Preferred; Tolerance: ±1%; Manufacturer Part Number: R1206_200K_1%_0.25W_100PPM; Case: 1206; Mounted: Yes; Sense: No; Socket: No; SMD: Yes; Manufacturer1 Example: NIC COMPONENT; Manufacturer1 ComponentHeight: 0.65mm; HelpURL: \\cern.ch\dfs\Applications\Altium\Datasheets\R1206_NIC_NRC.pdf; Author: CERN DEM JLC; CreateDate: 03.12.2007; LatestRevisionDate: 13.03.2008
R21 = R0603_20K_0.1%_0.063W_10PPM: Resistor - 0.1%; Part Description: Thin Film Chip Resistor; Manufacturer: GENERIC; Manufacturer1 Part Number: RN73C1J20KBTDF; Power: 0.063W; TC: ±10ppm; PressFit: No; Part Number: R0603_20K_0.1%_0.063W_10PPM; Component Kind: Standard; Component Type: Standard; Pin Count: 2; Value: 20k; Status: Not Recommended; Tolerance: ±0.1%; Manufacturer Part Number: R0603_20K_0.1%_0.063W_10PPM; Case: 0603; Mounted: Yes; Sense: No; Socket: No; SMD: Yes; Manufacturer1 Example: TYCO HOLSWORTHY; Manufacturer1 ComponentHeight: 0.5mm; HelpURL: \\cern.ch\dfs\Applications\Altium\Datasheets\R0603_Tyco_RN73.pdf; Author: CERN DEM JLC; CreateDate: 03.12.2007; LatestRevisionDate: 13.03.2008
R25 = R0402_2K_1%_0.0625W_100PPM: Resistor - 1%; Part Description: General Purpose Thick Film Chip Resistor; Manufacturer: GENERIC; Manufacturer1 Part Number: 232270672002L; TC: ±100ppm/°C; PressFit: No; Part Number: R0402_2K_1%_0.0625W_100PPM; Component Kind: Standard; Component Type: Standard; Pin Count: 2; Value: 2k; Status: Not Recommended; Power: 0.0625W; Tolerance: ±1%; Manufacturer Part Number: R0402_2K_1%_0.0625W_100PPM; Case: 0402; Mounted: Yes; Sense: No; Socket: No; SMD: Yes; Manufacturer1 Example: YAGEO PHYCOMP; Manufacturer1 ComponentHeight: 0.4mm; HelpURL: \\cern.ch\dfs\Applications\Altium\Datasheets\R0402_Phycomp_RC0402.pdf; Author: CERN DEM JLC; CreateDate: 03.12.2007; LatestRevisionDate: 17.10.2012
R34 R37 = R0402_1K6_1%_0.0625W_100PPM: Resistor - 1%; Part Description: General Purpose Thick Film Chip Resistor; Manufacturer: GENERIC; Manufacturer1 Part Number: 232270671602L; TC: ±100ppm/°C; PressFit: No; Part Number: R0402_1K6_1%_0.0625W_100PPM; Component Kind: Standard; Component Type: Standard; Pin Count: 2; Value: 1k6; Status: Not Recommended; Power: 0.0625W; Manufacturer Part Number: R0402_1K6_1%_0.0625W_100PPM; Case: 0402; Mounted: Yes; Sense: No; Socket: No; SMD: Yes; Manufacturer1 Example: YAGEO PHYCOMP; Manufacturer1 ComponentHeight: 0.4mm; HelpURL: \\cern.ch\dfs\Applications\Altium\Datasheets\R0402_Phycomp_RC0402.pdf; Author: CERN DEM JLC; CreateDate: 03.12.2007; LatestRevisionDate: 17.10.2012
R35 R36 = R0402_3K3_1%_0.0625W_100PPM: Resistor - 1%; Part Description: General Purpose Thick Film Chip Resistor; Manufacturer: GENERIC; Manufacturer1 Part Number: 232270673302L; TC: ±100ppm/°C; PressFit: No; Part Number: R0402_3K3_1%_0.0625W_100PPM; Component Kind: Standard; Component Type: Standard; Pin Count: 2; Value: 3k3; Status: Not Recommended; Power: 0.0625W; Manufacturer Part Number: R0402_3K3_1%_0.0625W_100PPM; Case: 0402; Mounted: Yes; Sense: No; Socket: No; SMD: Yes; Manufacturer1 Example: YAGEO PHYCOMP; Manufacturer1 ComponentHeight: 0.4mm; HelpURL: \\cern.ch\dfs\Applications\Altium\Datasheets\R0402_Phycomp_RC0402.pdf; Author: CERN DEM JLC; CreateDate: 03.12.2007; LatestRevisionDate: 17.10.2012
R38-R40 = R0402_470K_1%_0.0625W_100PPM: Resistor - 1%; Part Description: General Purpose Thick Film Chip Resistor; Manufacturer: GENERIC; Manufacturer1 Part Number: 232270674704L; TC: ±100ppm/°C; PressFit: No; Part Number: R0402_470K_1%_0.0625W_100PPM; Component Kind: Standard; Component Type: Standard; Pin Count: 2; Value: 470k; Status: Not Recommended; Power: 0.0625W; Tolerance: ±1%; Manufacturer Part Number: R0402_470K_1%_0.0625W_100PPM; Case: 0402; Mounted: Yes; Sense: No; Socket: No; SMD: Yes; Manufacturer1 Example: YAGEO PHYCOMP; Manufacturer1 ComponentHeight: 0.4mm; HelpURL: \\cern.ch\dfs\Applications\Altium\Datasheets\R0402_Phycomp_RC0402.pdf; Author: CERN DEM JLC; CreateDate: 03.12.2007; LatestRevisionDate: 17.10.2012
SW1 = SW_APEM_PT65121L508: Rotary Code Switch 1 2 3 4 C1 C2; Part Description: Rotary Decimal Code 4 Positions Right Angled Switch Whith Arrow Shaped Slot Actuator, PT65 (CR65) Series; Manufacturer: APEM; PressFit: No; Part Number: SW_APEM_PT65121L508; Component Kind: Standard; Component Type: Standard; Pin Count: 6; PackageDescription: Body 10x10mm, Right Angled Rotary Decimal Code 4 Positions Switch With Arrow Shaped Slot Actuator, APEM PT65 (CR65) Series; Family: Decimal; Mounted: Yes; Socket: No; SMD: No; Sense: No; Status: None; Manufacturer Part Number: PT65121L508; ComponentHeight: 10mm; HelpURL: \\cern.ch\dfs\Applications\Altium\Datasheets\SW_APEM_PT65121L508.pdf; Author: CERN DEM MR; CreateDate: 15.02.2016; LatestRevisionDate: 15.02.2016
T1 = Q_FQD3N60CTM: N-CHANNEL 600V, 2.4A, 3.4Ohm; Part Description: 600V 2.4A N-Channel Power MOSFET; Manufacturer: ONSEMI; PressFit: No; Bonding: No; Part Number: FQD3N60CTM; Component Kind: Standard; Component Type: Standard; Device: FQD3N60CTM; PackageDescription: TO-252AA DPAK TO, 2.28mm pitch; 2 pin,9.905mm L X 6.095mm W X 2.39mm H body, IPC Medium Density; Manufacturer Part Number: FQD3N60CTM; Pin Count: 3; Case: DPAK; Mounted: Yes; Socket: No; SMD: Yes; Sense: No; ComponentHeight: 2.38mm; HelpURL: \\cern.ch\dfs\Applications\Altium\Datasheets\IRFR224PBF.pdf; Author: GK; CreateDate: 25.07.2012; LatestRevisionDate: 25.07.2012
T2 = BC847B: NPN Transistor; Part Description: 45V 100mA NPN general-purpose transistors; Manufacturer: NXP SEMICONDUCTORS; PressFit: No; Bonding: No; Part Number: BC847B; Component Kind: Standard; Component Type: Standard; Device: BC847B; PackageDescription: SOT23, 3 pin, Pitch 0.95mm - 1.3mm W X 2.9mm L X 1.1mm H, IPC Medium Density; Manufacturer Part Number: BC847B; Pin Count: 3; Case: SOT23-3; Mounted: Yes; Socket: No; SMD: Yes; Sense: No; ComponentHeight: 1.1mm; HelpURL: \\cern.ch\dfs\Applications\Altium\Datasheets\BC847B.pdf; Author: CERN DEM JLC; CreateDate: 14.06.2011; LatestRevisionDate: 14.06.2011
T12-T14 = BSS138LT1G: N-CHANNEL MOSFET WITH DIODE; Part Description: 50V 200mA N-Channel Enhancement Mode Field-Effect Transistor; Manufacturer: ON SEMICONDUCTOR; PressFit: No; Bonding: No; Part Number: BSS138LT1G; Component Kind: Standard; Component Type: Standard; Device: BSS138LT1G; PackageDescription: SOT23 3-Leads, Pitch 0.95mm - Body 1.4x3mm, IPC Medium Density; Manufacturer Part Number: BSS138LT1G; Pin Count: 3; Case: SOT23-3; Mounted: Yes; Socket: No; SMD: Yes; Sense: No; ComponentHeight: 1.11mm; HelpURL: \\cern.ch\dfs\Applications\Altium\Datasheets\BSS138LT1G.pdf; Author: CERN DEM JLC; CreateDate: 23.03.2009; LatestRevisionDate: 23.03.2009
TP1 TP2 = SMD_PAD_1.27X1.27MM: as TP14 on sheet Stabilizer_Piezo_Driver; Part Number: SMD_PAD_1.27X1.27MM; Component Kind: Standard (No BOM); Component Type: Standard (No BOM); Pin Count: 1; Family: Test Point; Socket: No; SMD: Yes; Sense: No; Status: None; ComponentHeight: 0mm; HelpURL: Undefined; Author: CERN DEM JLC; CreateDate: 12/01/2008; LatestRevisionDate: 12/01/2008; PackageDescription: 1.27mm x 1.27mm PCB Copper Area (SMD Test Point)

## Sheet mechanics.SchDoc: Stabilizer Piezo Driver
size 420 x 297 mm; CheckedBy: G. Kasprowicz; Author: Jakub Kajzer; CompanyName: WUT ISE; DrawnBy: Jakub Kajzer; Organization: WUT ISE; Address1: PW ISE; Address2: Nowowiejska 15/19 00-665 Warsaw; Address3: gkasprow@gmail.com; DocumentNumber: 7; Revision: 2; SheetNumber: 7; SheetTotal: 7; ModifiedBy: -; CreateDate: 03.08.2020; CheckedDate: -; Title2: mechanics; DivGrp: WUT ISE; Designer: Jakub Kajzer; ModifiedDate: -; ProjectName: Sensor Box
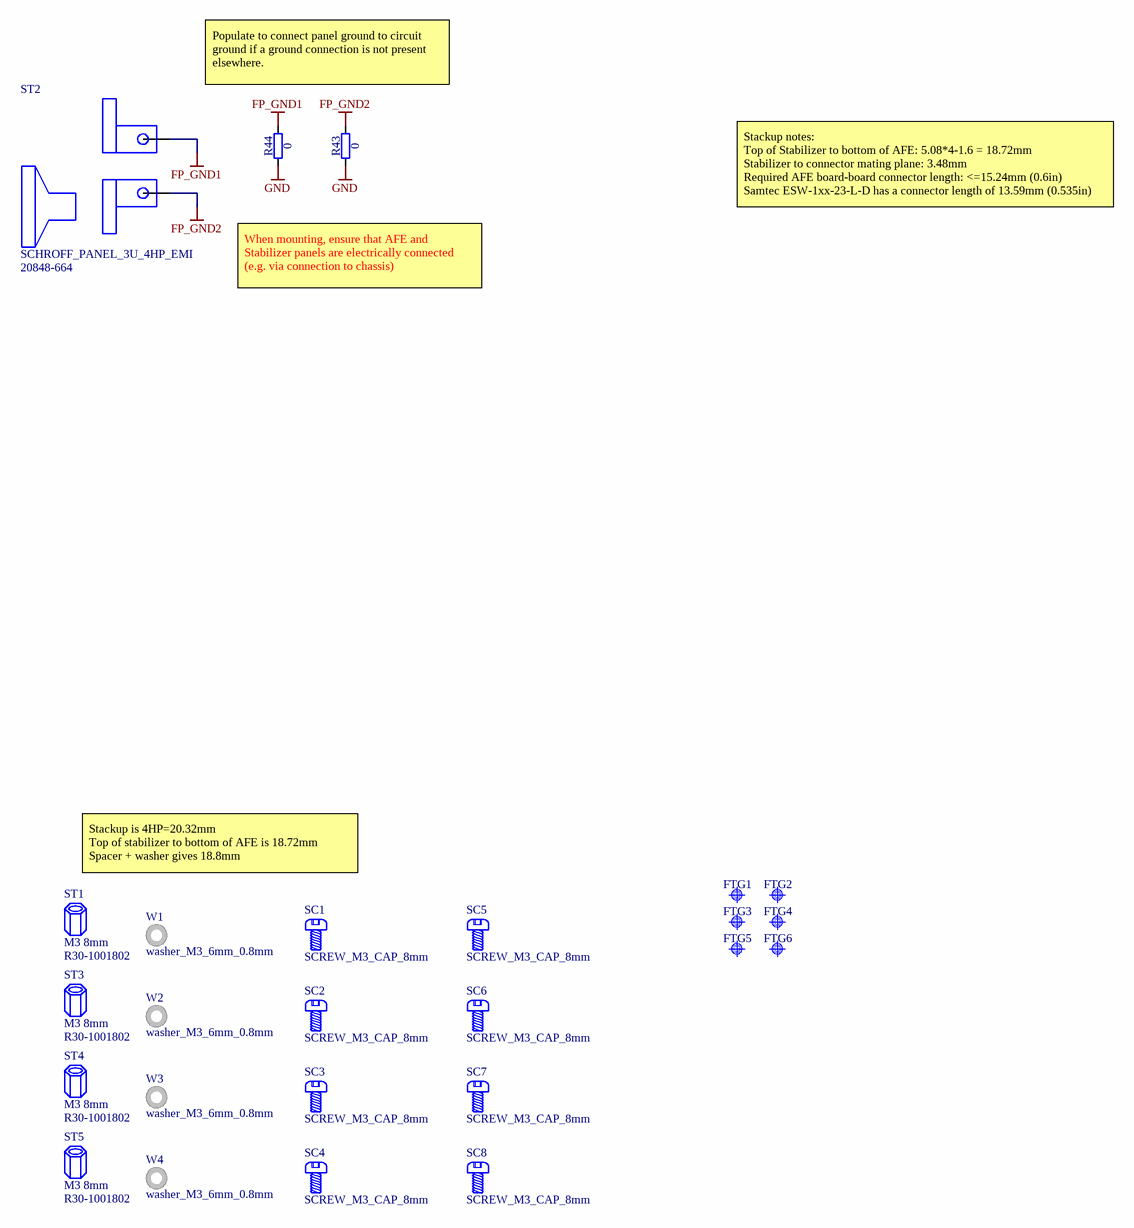
[diagram p2: mechanics.SchDoc]

### Parts
FTG1  Use only in PCB  [FIDUCIAL_TOP_C100-200]  (value not drawn)
FTG2  Use only in PCB  [FIDUCIAL_TOP_C100-200]  (value not drawn)
FTG3  Use only in PCB  [FIDUCIAL_TOP_C100-200]  (value not drawn)
FTG4  Use only in PCB  [FIDUCIAL_TOP_C100-200]  (value not drawn)
FTG5  Use only in PCB  [FIDUCIAL_TOP_C100-200]  (value not drawn)
FTG6  Use only in PCB  [FIDUCIAL_TOP_C100-200]  (value not drawn)
R43  0  [RESC1608X55N]
R44  0  [RESC1608X55N]
SC1  SCREW_M3_CAP_8mm  [SCREW_M3_CAP_8mm]
SC2  SCREW_M3_CAP_8mm  [SCREW_M3_CAP_8mm]
SC3  SCREW_M3_CAP_8mm  [SCREW_M3_CAP_8mm]
SC4  SCREW_M3_CAP_8mm  [SCREW_M3_CAP_8mm]
SC5  SCREW_M3_CAP_8mm  [SCREW_M3_CAP_8mm]
SC6  SCREW_M3_CAP_8mm  [SCREW_M3_CAP_8mm]
SC7  SCREW_M3_CAP_8mm  [SCREW_M3_CAP_8mm]
SC8  SCREW_M3_CAP_8mm  [SCREW_M3_CAP_8mm]
ST1  M3 8mm  [R30-1001802]
ST2  SCHROFF_PANEL_3U_4HP_EMI  Manufacturer Part Number: 20848-664  [SCHROFF_PANEL_3HP_4U]
ST3  M3 8mm  [R30-1001802]
ST4  M3 8mm  [R30-1001802]
ST5  M3 8mm  [R30-1001802]
W1  washer_M3_6mm_0.8mm  [washer_M3_6mm_0.8mm]
W2  washer_M3_6mm_0.8mm  [washer_M3_6mm_0.8mm]
W3  washer_M3_6mm_0.8mm  [washer_M3_6mm_0.8mm]
W4  washer_M3_6mm_0.8mm  [washer_M3_6mm_0.8mm]

### Nets
FP_GND1: R44.2 ST2.1
FP_GND2: R43.2 ST2.0
GND: R43.1 R44.1

### Notes on the sheet
- Populate to connect panel ground to circuit ground if a ground connection is not present elsewhere.
- Stackup notes:
  Top of Stabilizer to bottom of AFE: 5.08*4-1.6 = 18.72mm
  Stabilizer to connector mating plane: 3.48mm
  Required AFE board-board connector length: <=15.24mm (0.6in)
  Samtec ESW-1xx-23-L-D has a connector length of 13.59mm (0.535in)
- When mounting, ensure that AFE and Stabilizer panels are electrically connected (e.g. via connection to chassis)
- Stackup is 4HP=20.32mm
  Top of stabilizer to bottom of AFE is 18.72mm
  Spacer + washer gives 18.8mm
- Project/Equipment
- Document
- Designer
- Drawn by
- Check.by
- Copyright WUT ISE 2018.
  This documentation describes Open Hardware and is licensed under the CERN OHL v.1.1. You may redistribute and modify this documentation under the terms of the CERN OHL v.1.1. (http://ohwr.org/CERNOHL). This documentation is distributed WITHOUT ANY EXPRESS OR IMPLIED WARRANTY, INCLUDING OF MERCHANTABILITY, SATISFACTORY QUALITY AND FITNESS FOR A PARTICULAR PURPOSE. Please see the CERN OHL v.1.1 for applicable conditions.
- Contact
- File
- Last Mod.
- Print Date
- Sheet
- Size
- A3
- of
- Rev

### Library data of the parts
FTG1-FTG6 = FIDUCIAL_TARGET_C100-200: Fiducial Target; Part Description: Round Fiducial Target, Top Layer, 1.0mm, Top Solder 2.0mm, Keepout =2.0mm; Mounted: No; Part Number: FIDUCIAL_TARGET_C100-200; Component Kind: Standard (No BOM); Component Type: Standard (No BOM); Pin Count: 1; Family: Fiducial; Socket: No; SMD: Yes; Sense: No; Status: None; ComponentHeight: 0mm; HelpURL: Undefined; Author: CERN DEM JLC; CreateDate: 09/02/2010; LatestRevisionDate: 04/04/2012; PackageDescription: Round Fiducial Target, Top Layer, 1.0mm, Top Solder 2.0mm, Keepout =2.0mm
R43 R44 = R0603_0R_JUMPER: Resistor; Part Description: 1A (0.05R Max DC Resistance) Zero Ohm Jumper; Manufacturer: GENERIC; Manufacturer1 Part Number: NRC06Z0; PressFit: No; Part Number: R0603_0R_JUMPER; Component Kind: Standard; Component Type: Standard; Pin Count: 2; Value: 0; Status: Preferred; Manufacturer Part Number: R0603_0R_JUMPER; Case: 0603; Mounted: Yes; Sense: No; Socket: No; SMD: Yes; Manufacturer1 Example: NIC COMPONENT; Manufacturer1 ComponentHeight: 0.55mm; HelpURL: \\cern.ch\dfs\Applications\Altium\Datasheets\R0603_NIC_NRC.pdf; Author: CERN DEM JLC; CreateDate: 03/12/2007; LatestRevisionDate: 13/03/2008
SC1-SC8 = SCREW_M3_CAP_8mm: M3 x 8mm cap head screw; Manufacturer: Accu Limited; Manufacturer Part Number: SSCF-M3-8-12.9-Z
ST1 ST3-ST5 = STANDOFF_HARWIN_R30_1001802: M3.0x18 standoff; Manufacturer: Harwin; Manufacturer Part Number: R30-1001802
ST2 = SCHROFF_PANEL_3U_4HP_EMI: Schroff 3HP 4U EUROCARD Panel with EMI gaskets kit; Manufacturer: Schroff
W1-W4 = washer_M3_6mm_0.8mm: M3 Washer: / ID: 3.2mm / OD: 6mm / Thickness 0.8mm; Manufacturer: Accu Limited; Manufacturer Part Number: HAFZ-M3-A4